# Altium schematic sheet DiagramElectical.SchDoc
size A3; SheetNumber: 4; SheetTotal: 5
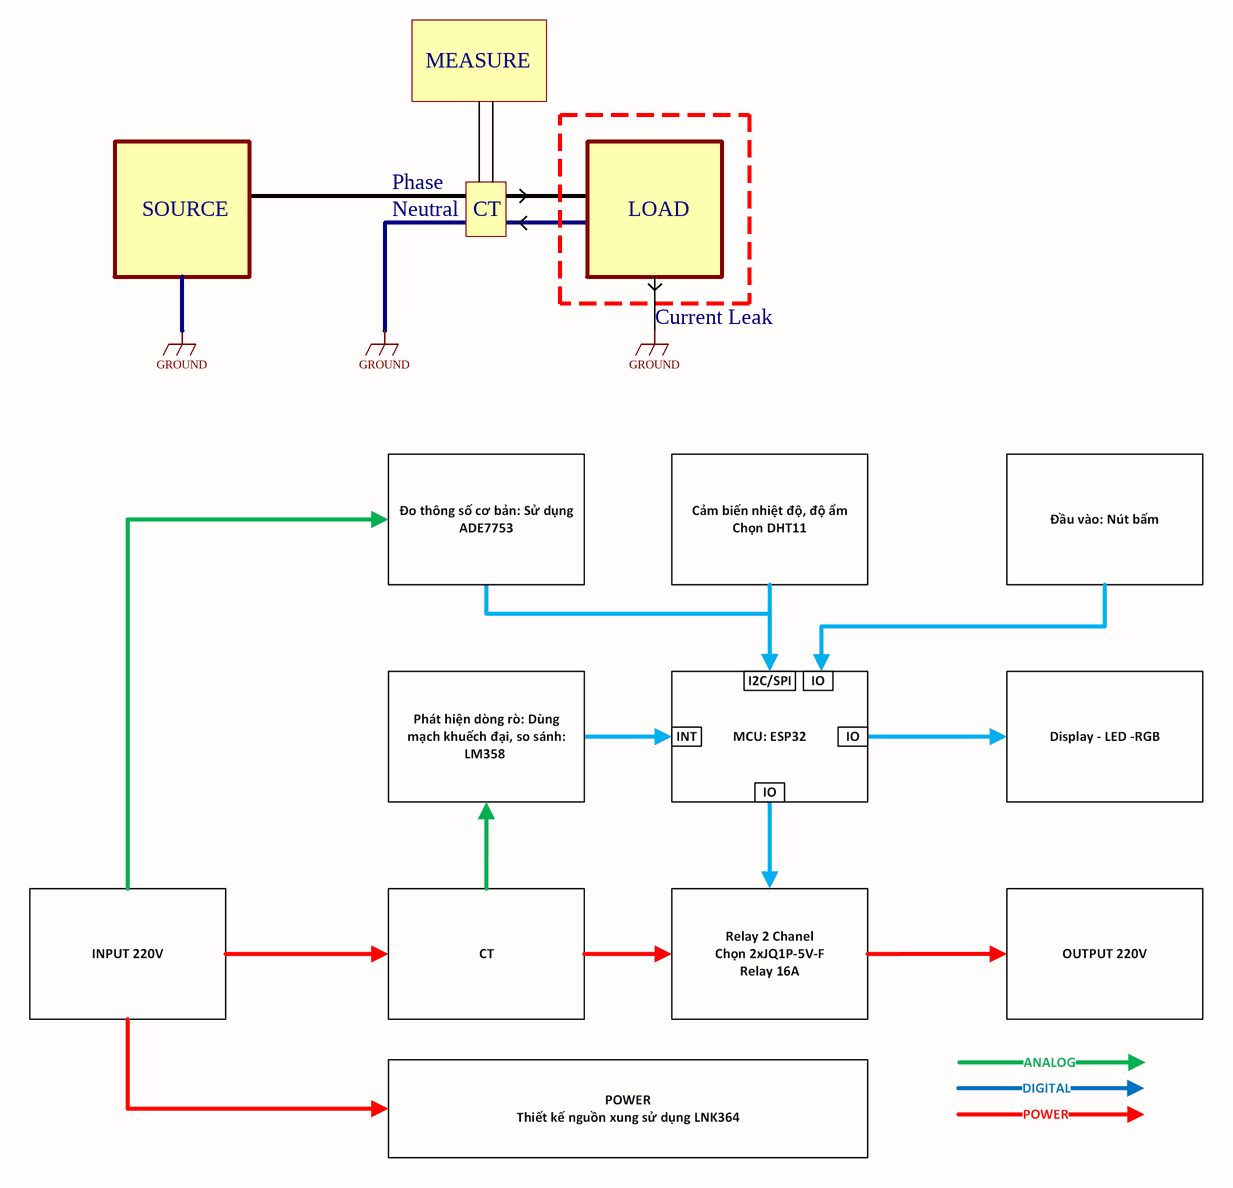
[diagram p0: DiagramElectical.SchDoc]

## Notes on the sheet
- MEASURE
- SOURCE
- Phase
- Neutral
- CT
- LOAD
- Current Leak
- Labels drawn without touching a wire or pin: GROUND